# EAGLE design Zigbee Tracker v2 Debugger (EAGLE 9.5.0)
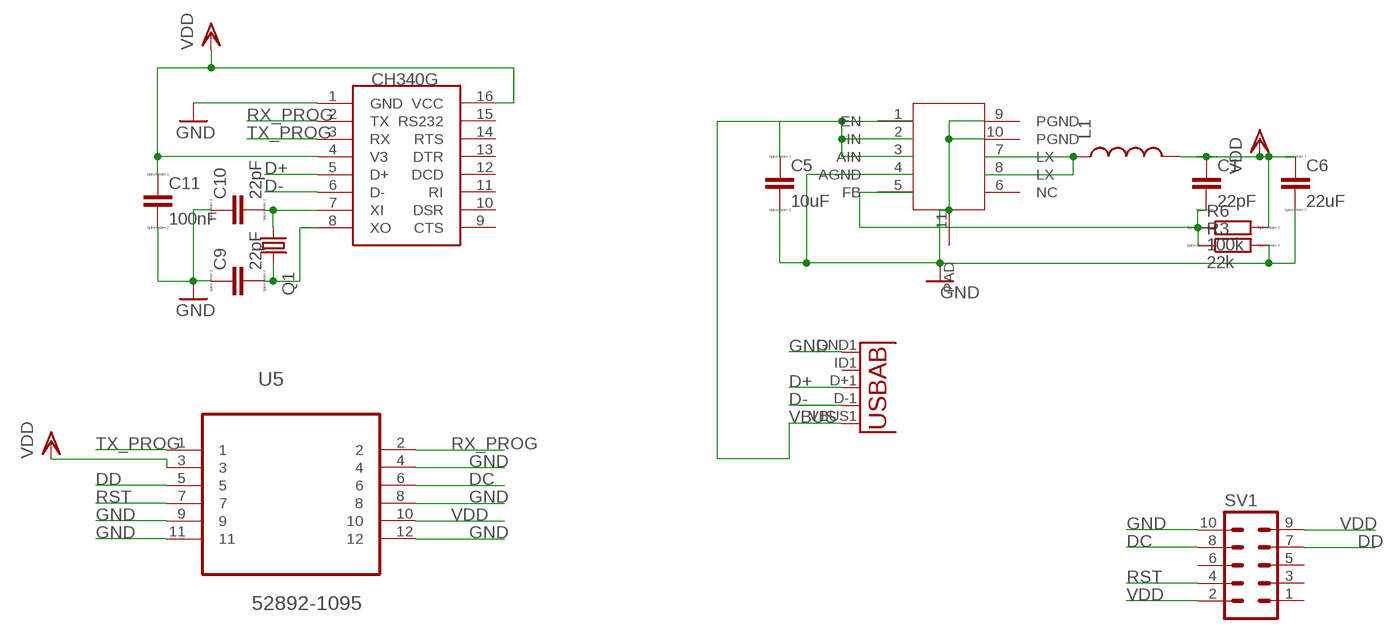
[diagram p0: schematic, sheet 1]

## Parts
C1  22pF  CC0402  [C0402]
C5  10uF  CC0402  [C0402]
C6  22uF  CC0402  [C0402]
C9  22pF  CC0402  [C0402]
C10  22pF  CC0402  [C0402]
C11  100nF  CC0402  [C0402]
L1  INDUCTOR  [L0603]
Q1  KX-7  [3.2X2.5_KX-7]
R3  22k  RR0402  [R0402]
R6  100k  RR0402  [R0402]
SV1  MA05-2  [MA05-2]
U1  USB""  [USB-MICRO-SMD]
U5  52892-1095  [MOLEX_52892-1095]
U$1  XM5152  [SON50P300X300X80-11T170X240]
U$2  CH340G  [SOIC16]

## Nets
D+: U1.D+1(D+) U$2.5(D+)
D-: U1.D-1(D-) U$2.6(D-)
DC: SV1.8 U5.6
DD: SV1.7 U5.5
GND: C5.2 C6.2 C9.1 C10.1 C11.2 R3.2 SV1.10 U1.GND1(GND) U5.4 U5.8 U5.9 U5.11 U5.12 U$1.4(AGND) U$1.9(PGND) U$1.10(PGND) U$1.11(PAD) U$2.1(GND)
N$6: L1.1 U$1.7(LX) U$1.8(LX)
N$13: C9.2 Q1.3 U$2.8(XO)
N$14: C10.2 Q1.1 U$2.7(XI)
N$16: C1.2 R3.1 R6.1 U$1.5(FB)
RST: SV1.4 U5.7
RX_PROG: U5.2 U$2.2(TX)
TX_PROG: U5.1 U$2.3(RX)
VBUS: C5.1 U1.VBUS1(VBUS) U$1.1(EN) U$1.2(IN) U$1.3(AIN)
VDD: C1.1 C6.1 C11.1 L1.2 R6.2 SV1.2 SV1.9 U5.3 U5.10 U$2.4(V3) U$2.16(VCC)
Unconnected: SV1.1 SV1.3 SV1.5 SV1.6 U1.ID1(USBID) U$1.6(NC) U$2.9(CTS) U$2.10(DSR) U$2.11(RI) U$2.12(DCD) U$2.13(DTR) U$2.14(RTS) U$2.15(RS232)

## Library data of the parts
C1 C5 C6 C9-C11 = eagle-ltspice:C: CAPACITOR, European symbol; SPICEMODEL: NONE; SPICEPREFIX: C
L1 = BeagleBone_Blue_R3:INDUCTOR: Inductors Basic Inductor/Choke - 0603 and 1206. Footprints are not proven and vary greatly between part numbers. SRN6045- 33uH, 20% 1.4A
Q1 = crystal-geyer_V1_0:KX: Quartz Crystals (MHz) SMD: KX - Serie Model Size l/w/h [mm] Frequency Range Frequency Stability Temp. Range [°C] Load Capacitance AECQ 200 availabel Datasheet KX-4 KX-5 KX-6 KX-7 KX-9A KX-9B KX-12A KX-12B KX-13 KX-20 KX-K KX-KS 1.6/1.2/0.3 2.0/1.6/0.45 2.5/2.0/0.55 3.2/2.5/0.8 5.0/3.2/1.0 5.0/3.2/1.1 6.0/3.5/1.1 6.0/3.5/1.0 7.0/5.0 /1.3 11.6/5.5/1.6 12.3/4.5/4.2 12.3/4.5/3.2 24.0 ~ 80.0 MHz 16.0 ~ 80.0 MHz 12.0 ~ 80.0 MHz 8.0 ~ 60.0 MHz 7,68 ~ 300,0 MHz 8,0 ~ 50,0 MHz 8,0 ~ 150,0 MHz 8,0 ~ 50,0 MHz 6,0 ~ 160,0 MHz 3,579 ~ 25,0 MHz 3,579 ~ 70,0 MHz 3,579 ~ 70,0 MHz ±10 … ±50ppm ±10 … ±50ppm ±10 … ±50ppm ±10 … ±50ppm ±10 … ±50ppm ±10 … ±50ppm ±10 … ±50ppm ±10 … ±50ppm ±10 … ±50ppm ±50ppm ±10 … ±50ppm ±10 … ±50ppm (*) -40°C …+85°C (*) -40°C …+125°C (*) -40°C …+125°C (*) -40°C …+125°C (*) -40°C …+105°C (*) -40°C …+105°C (*) -40°C …+125°C (*) -40°C …+105°C (*) -40°C …+105°C (*) -40°C …+105°C (*) -40°C …+85°C (*) -40°C …+85°C 8, 8…16 8, 8…16 10, 8…16 12, 7…20 16, 10…20 16, 10…20 16, 10…20 16, 12…20 16, 12…20 16, 12…20 16, 12…30 16, 12…30 - yes yes yes - - - - - - - - KX-4.pdf <http://www.geyer-electronic.de/uploads/tx_userartikelfrequenz/GEYER-KX-4.pdf> KX-5.pdf <http://www.geyer-electronic.de/uploads/tx_userartikelfrequenz/GEYER-KX-5.pdf> KX-6.pdf <http://www.geyer-electronic.de/uploads/tx_userartikelfrequenz/GEYER-KX-6.pdf> KX-7.pdf <http://www.geyer-electronic.de/uploads/tx_userartikelfrequenz/GEYER-KX-7.pdf> KX-9A.pdf <http://www.geyer-electronic.de/uploads/tx_userartikelfrequenz/GEYER-KX-9A.pdf> KX-9B.pdf <http://www.geyer-electronic.de/uploads/tx_userartikelfrequenz/GEYER-KX-9B.pdf> KX-12A.pdf <http://www.geyer-electronic.de/uploads/tx_userartikelfrequenz/GEYER-KX-12A.pdf> KX-12B.pdf <http://www.geyer-electronic.de/uploads/tx_userartikelfrequenz/GEYER-KX-12B.pdf> KX-13.pdf <http://www.geyer-electronic.de/uploads/tx_userartikelfrequenz/GEYER-KX-13.pdf> KX-20.pdf <http://www.geyer-electronic.de/uploads/tx_userartikelfrequenz/GEYER-KX-20.pdf> KX-K.pdf <http://www.geyer-electronic.de/uploads/tx_userartikelfrequenz/GEYER-KX-K.pdf> KX-KS.pdf <http://www.geyer-electronic.de/uploads/tx_userartikelfrequenz/GEYER-KX-KS.pdf> <http://www.geyer-electronic.de/fileadmin/template/img/logo-geyer-electronic.png> Details see: http://www.geyer-electronic.de/Frequenz-Produkte.9.0.html Created 2016-06-07, Hans Locher 2016 (C) Geyer Quartz Technology KX4,KX5,KX6,KX7,KX9A,KX9B,KX12A,KX12B,KX13,KX20,KXK,KXKS;1612;2016;2520;3225;5032;6035;7050;11655;12345;1,6x1,2;2,0x1,6;2,5x2,0;3,2x2,5;5,0x3,2;6,0x3,5;7,0x5,0;11,6x5,5;12,3x4,5;12,3x4,5;1.6x1.2;2.0x1.6;2.5x2.0;3.2x2.5;5.0x3.2;6.0x3.5;7.0x5.0;11.6x5.5;12.3x4.5;12.3x4.5;
R3 R6 = eagle-ltspice:R: RESISTOR, European symbol; SPICEMODEL: NONE; SPICEPREFIX: R
SV1 = con-lstb:MA05-2: PIN HEADER; OC_FARNELL: unknown; OC_NEWARK: unknown
U1 = MicroUSB:USB: This is a USB AB connector that is compatible with USB OTG. i.e. this connector can serve as a host or device
U5 = 52892-1095:52892-1095: CONNECTOR, FPC, ZIF, 0.50MM, 10 WAY; AVAILABILITY: Unavailable; DESCRIPTION: Socket, r/a, Fpc, Zif, Smt, 10way; MF: Molex; MP: 52892-1095; PACKAGE: None; PRICE: None
U$1 = xm5152:XM5152
U$2 = ch340g:CH340G

## Board
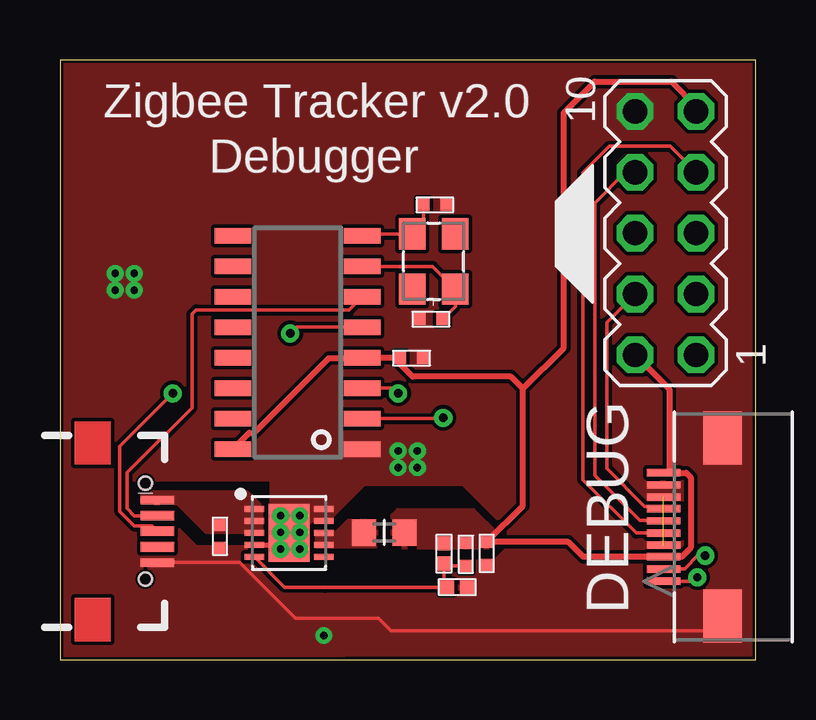
[diagram p1: board, top side]
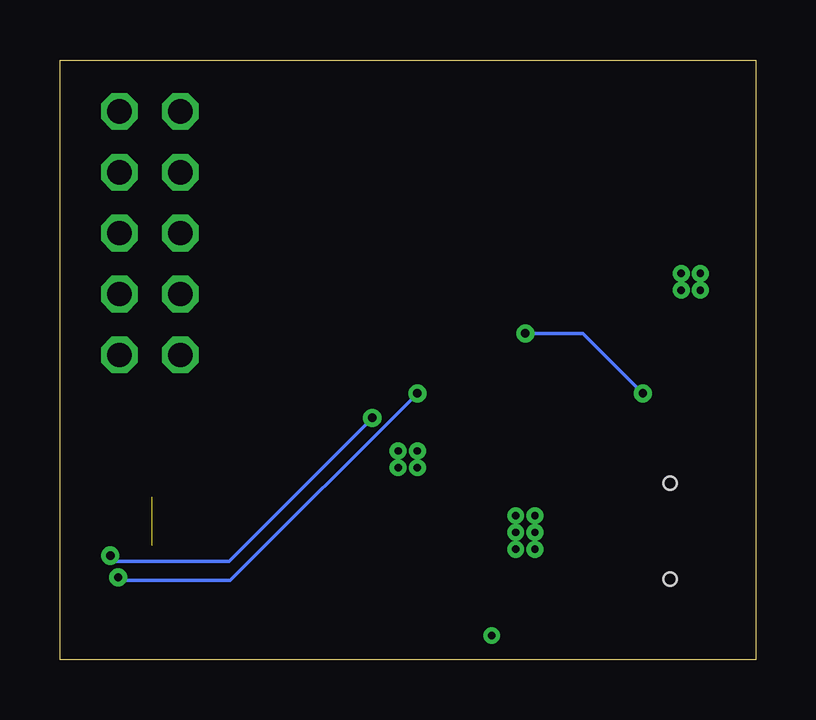
[diagram p2: board, bottom side, seen from below]

Size 29 x 25 mm. Coordinates in mm from the lower left corner, seen from the top.
Outline: 0,0 29,0 29,25 0,25 0,0
Copper layers (1*16): Top 0.035mm / dielectric 1.5mm / Bottom 0.035mm
Design rules "default *": minimum track width 6mil, minimum drill 0.35mm, track to track 6mil, track to pad 6mil, pad to pad 6mil, via to via 6mil, smd to smd 6mil, copper to edge 5mil, drill to drill 3mil, minimum pad ring 10mil, minimum via ring 8mil, stop-mask expansion 0mil, vias tented up to drill 40mil, thermal gap 0mil

### Footprints (pad centres in the part's own frame; a part is rotated, then mirrored left to right if it is on the bottom)
C0402 = smd 0.5 x 0.5: 1 -0.475,0; 2 0.475,0
L0603 = smd 1 x 1.1: 1 -0.85,0; 2 0.85,0
3.2X2.5_KX-7 = smd 1.3 x 1.1: 1 -1.15,-0.9; 2 1.15,-0.9; 3 1.15,0.9; 4 -1.15,0.9
R0402 = smd 0.6 x 0.55: 1 -0.425,0; 2 0.425,0
MA05-2 = drill 1.016 octagon: 1 -5.08,-1.27; 2 -5.08,1.27; 3 -2.54,-1.27; 4 -2.54,1.27; 5 0,-1.27; 6 0,1.27; 7 2.54,-1.27; 8 2.54,1.27; 9 5.08,-1.27; 10 5.08,1.27
USB-MICRO-SMD = smd 1.4 x 0.4: D+1 2.7,0; D-1 2.7,0.65; ID1 2.7,-0.65 | smd 1.4 x 0.35: GND1 2.7,-1.3; VBUS1 2.7,1.3 | hole 0.55: 2.2,2; 2.2,-2
MOLEX_52892-1095 = smd 0.305 x 1.397: 1 2.261,2.896; 2 1.753,2.896; 3 1.245,2.896; 4 0.762,2.896; 5 0.254,2.896; 6 -0.254,2.896; 7 -0.762,2.896; 8 -1.245,2.896; 9 -1.753,2.896; 10 -2.261,2.896 | smd 2.21 x 1.6: 11 -3.702,5.359; 12 3.702,5.359
SON50P300X300X80-11T170X240 = smd 0.81 x 0.25: 1 -1.445,1; 2 -1.445,0.5; 3 -1.445,0; 4 -1.445,-0.5; 5 -1.445,-1; 6 1.445,-1; 7 1.445,-0.5; 8 1.445,0; 9 1.445,0.5; 10 1.445,1 | smd 1.7 x 2.4: 11 0,0
SOIC16 = smd 0.635 x 1.524: 1 -4.445,-2.695; 2 -3.175,-2.695; 3 -1.905,-2.695; 4 -0.635,-2.695; 5 0.635,-2.695; 6 1.905,-2.695; 7 3.175,-2.695; 8 4.445,-2.695; 9 4.445,2.695; 10 3.175,2.695; 11 1.905,2.695; 12 0.635,2.695; 13 -0.635,2.695; 14 -1.905,2.695; 15 -3.175,2.695; 16 -4.445,2.695

### Placement (x,y rotation side)
C1  16.92,4.39 270 top
C5  6.67,5.14 270 top
C6  17.79,4.43 270 top
C9  15.63,18.96 180 top
C10  15.47,14.19 0 top
C11  14.66,12.57 0 top
L1  13.52,5.3 0 top
Q1  15.58,16.6 90 top
R3  16.56,3.02 0 top
R6  16.01,4.42 90 top
SV1  25.25,17.78 90 top
U1  1.36,5.35 0 top
U5  22.27,5.53 270 top
U$1  9.55,5.28 0 top
U$2  9.91,13.22 90 top

### Tracks (layer width: path | path; a pad name or v marks a point on that pad's centre or on a via)
D+  (via drill 0.35)
  Top 0.152: U1.D+1 3.84,5.57 3.1,5.57 2.5,6.17 2.5,8.89 v4.7,11.1 | v9.6,13.6 9.86,13.86 U$2.5
  Bottom 0.152: v4.7,11.1 7.2,13.6 v9.6,13.6
D-
  Top 0.152: U1.D-1 3.1,6 2.8,6.3 2.8,7.8 5.5,10.5 5.5,14.4 5.68,14.58 12.06,14.58 U$2.6
DC
  Top 0.152: U5.6 25.02,5.78 24.99,5.81 24.17,5.81 22.3,7.68 22.3,19.04 23.58,20.32 SV1.8
DD
  Top 0.152: U5.5 24.02,5.28 21.8,7.5 21.8,20.3 22.9,21.4 25.44,21.4 SV1.7
GND  (via drill 0.3)  (1 unrouted)
  Top 0.152: U1.GND1 7.48,4.05 9.82,1.72 13.29,1.72 13.8,1.2 27,1.2 U5.12
  Top 0.2: U$1.4 9.02,4.78 v9.2,4.6
  other vias: 10,4.6 10,5.3 9.2,5.3 10,6 9.2,6 11,1 14.9,8 14.1,8 14.9,8.7 14.1,8.7 3.1,15.4 2.3,15.4 3.1,16.1 2.3,16.1
  pour Top: 10.3,4.2 10.3,5.6 10.5,5.8 11.2,5.8 12.7,7.3 16.8,7.3 18.7,5.4 18.7,4.7 18.1,4.1 11.2,4.1 11.2,0.5 11.5,0.2 28.9,0.2 28.9,25 0.2,25 0.2,0.1 10.1,0.1 10.9,0.9 10.9,3.6 8.8,3.6 7.7,4.7 5.7,4.7 4.8,5.6 3.5,5.6 3,6.1 3,7.5 8.8,7.5 8.8,4.2
  pour Top: 10.2,0.1 10.1,0.2 10.1,2.7 11.8,2.7 11.8,0.1
N$6
  pour Top: 10.7,4.7 10.7,5.3 11.5,5.3 11.7,5.5 12,5.8 12.3,5.8 13.2,5.8 13.2,4.7
N$13
  Top 0.152: U$2.8 12.69,17.75 Q1.3 15.15,18.23 C9.2
N$14
  Top 0.152: U$2.7 15.54,16.39 Q1.1 16.48,14.72 C10.2
N$16
  Top 0.152: C1.2 16.09,3.92 R6.1 16.01,3.15 R3.1 9.37,3.02 U$1.5
RST
  Top 0.152: U5.7 25.06,6.39 24.37,6.39 22.8,7.97 22.8,14.06 SV1.4
RX_PROG  (via drill 0.35)
  Top 0.152: U$2.2 15.95,10.04 v15.98,10.08 | v26.9,4.34 26.6,4.34 26.04,3.78 U5.2
  Bottom 0.152: v15.98,10.08 21.96,4.1 26.9,4.1 v26.9,4.34
TX_PROG  (via drill 0.35)
  Top 0.152: U$2.3 13.88,11.31 v14.1,11.1 | v26.57,3.43 26.42,3.27 U5.1
  Bottom 0.152: v14.1,11.1 21.9,3.3 26.57,3.3 v26.57,3.43
VBUS
  pour Top: 3.4,6.5 3.4,7 7.8,7 8.4,6.4 8.4,5.3 6.1,5.3 4.9,6.5
VDD
  Top 0.152: C11.1 14.1,12.57 12.7,12.57 12.62,12.57 U$2.4
  Top 0.254: U5.10 25.4,7.79 | 25.4,7.79 26.11,7.79 26.3,7.6 26.3,4.66 25.93,4.29 U5.3 21.82,4.29 21.2,4.91 C6.1 19.3,6.42 19.3,11.3 | 19.3,11.3 21,13 21,22.8 22.3,24.1 25.5,24.1 26.52,23.08 SV1.9 | 19.3,11.3 18.8,11.8 14.7,11.8 14.19,12.31 C11.1 | U$2.16 7.89,9.45 8.09,9.45 11.21,12.57 12.7,12.57 | U$2.4 14.09,12.59 14.1,12.57 | SV1.2 25.4,11.28 25.4,7.79
  pour Top: 13.9,4.8 13.9,6 14.1,6.2 17.2,6.2 17.4,6 18,5.4 18,4.7 14,4.7

### Text on the board
tPlace: Zigbee Tracker v2.0 | Debugger | DEBUG